# EasyEDA Pro project jtag_pin_convert.eprj

# Schematic Schematic1
Board Name: Board1; Create Date: 2024-12-11; Page Name: P1; Project Name: jtag_pin_convert; Schematic Name: Schematic1; Update Date: 2025-03-21; Company: 嘉立创EDA; Page Size: A4; Version: V1.0
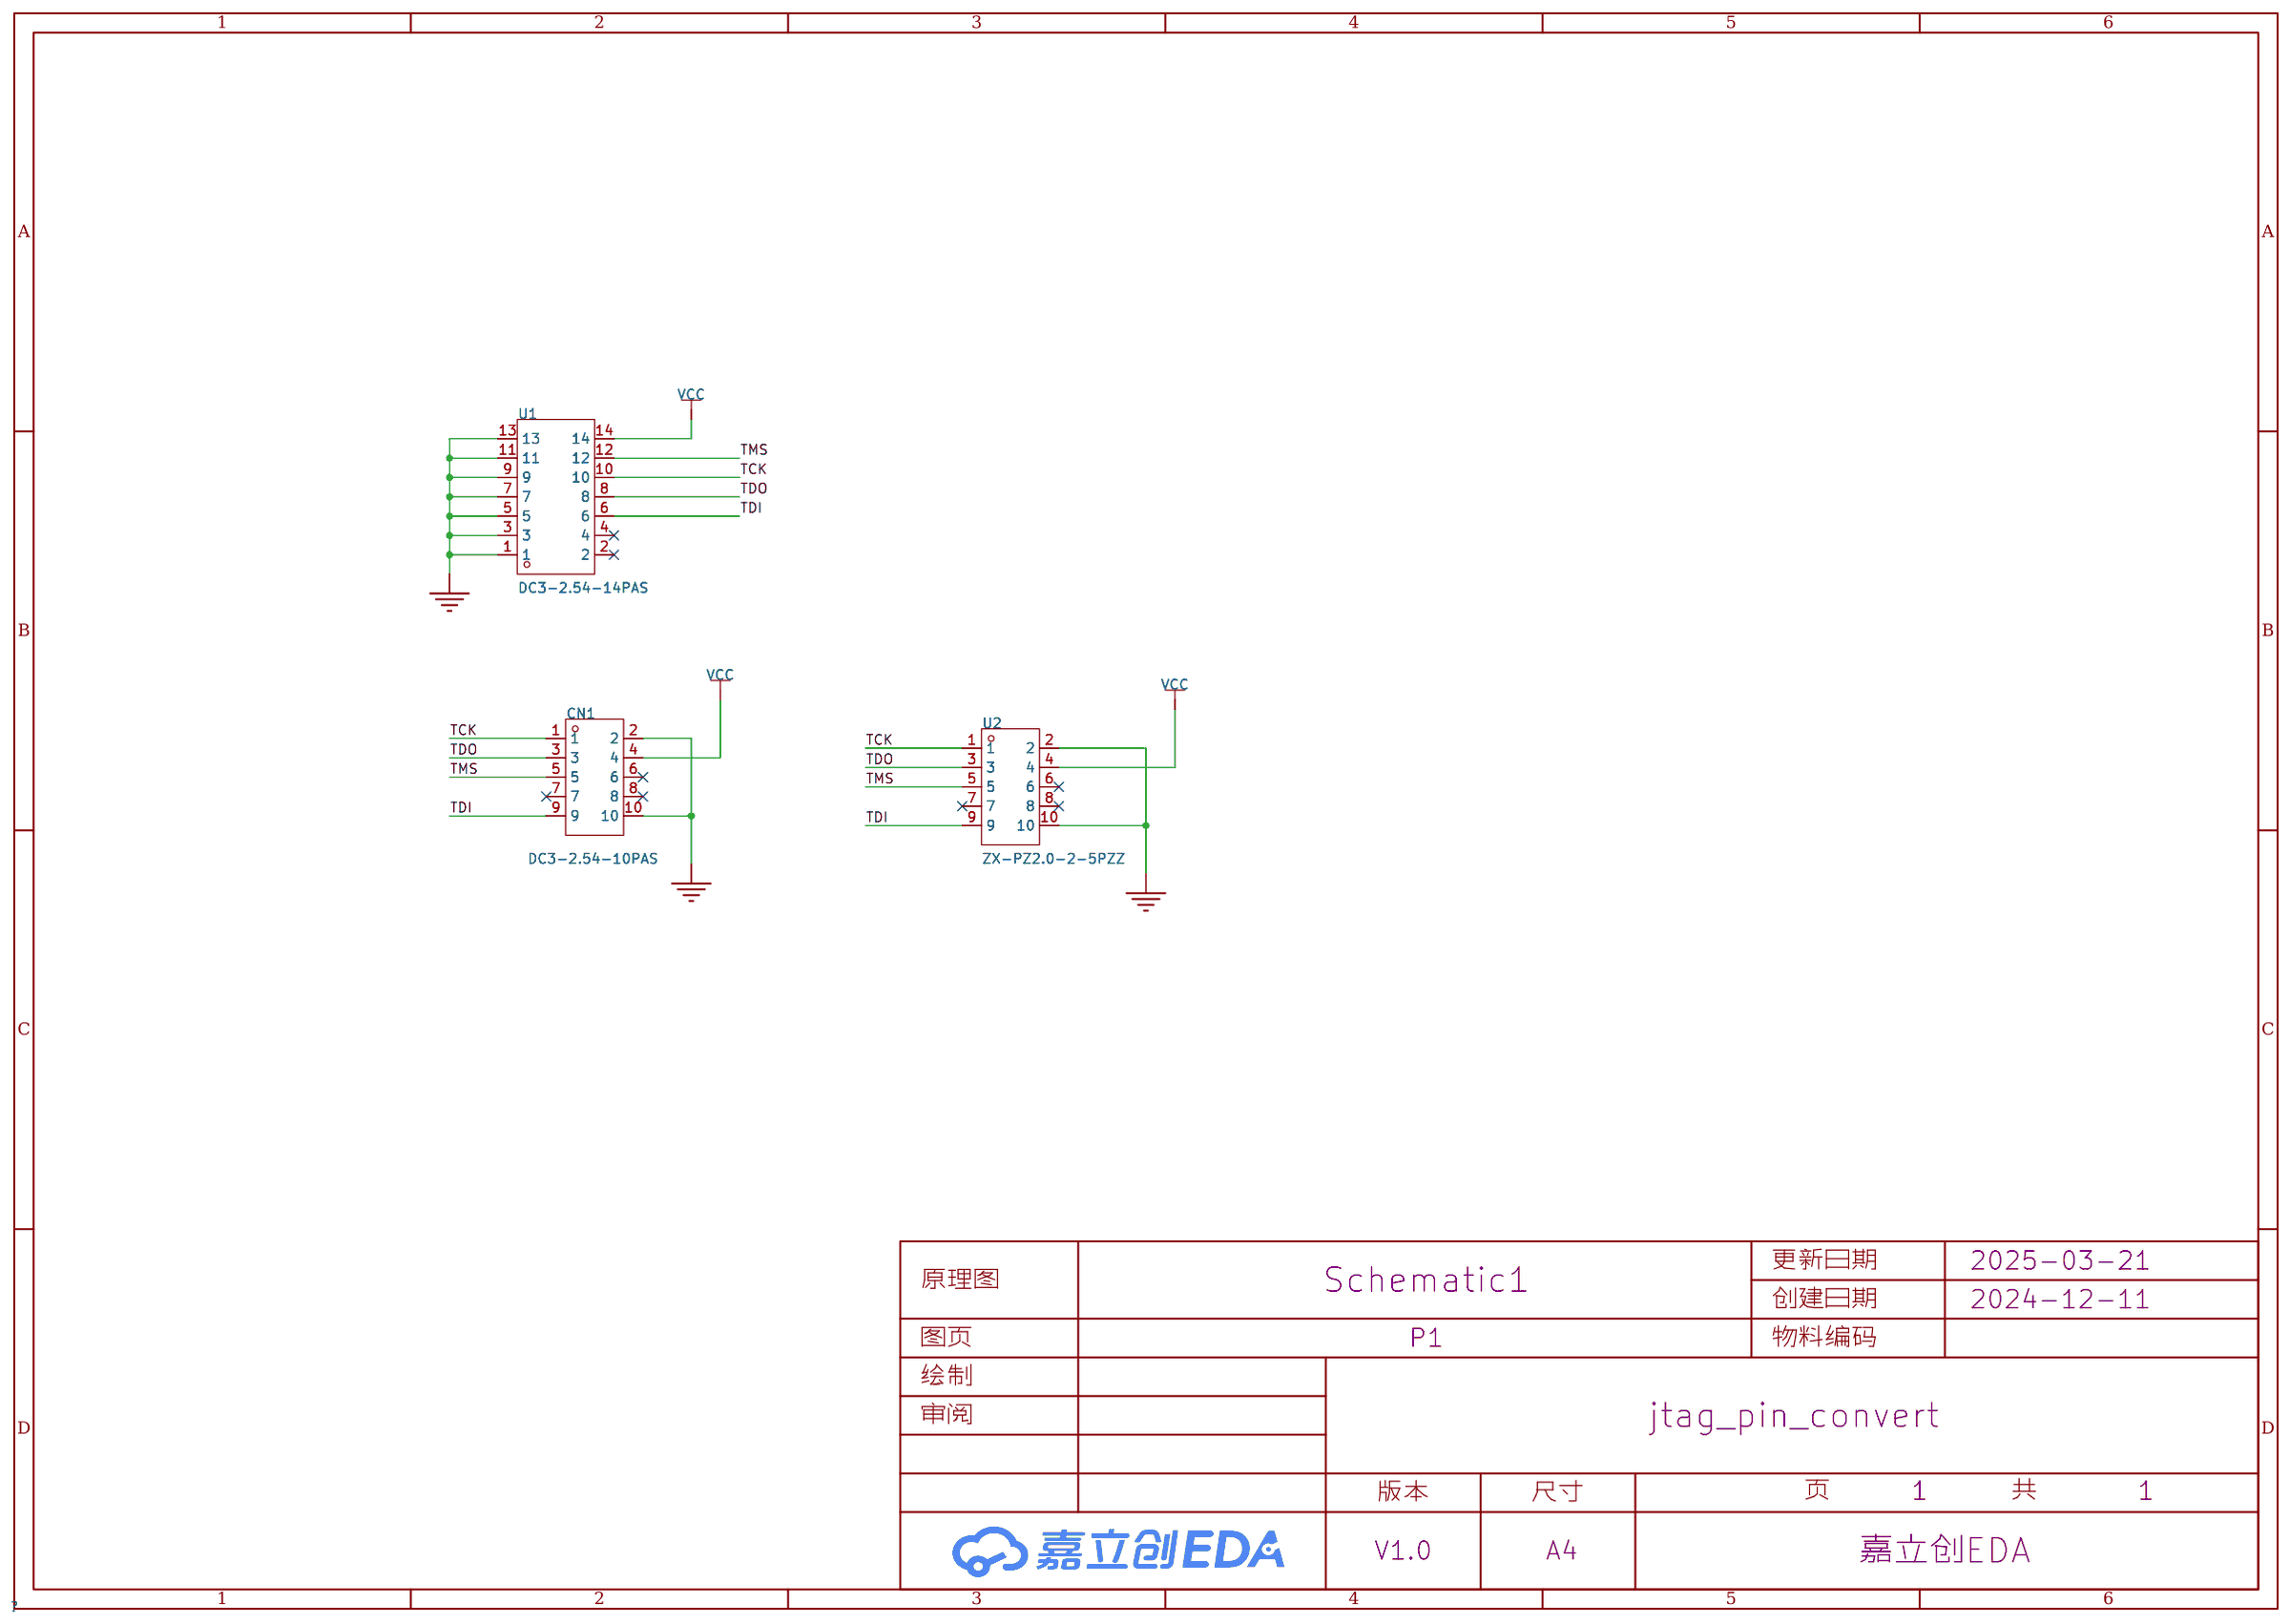
[diagram p0: schematic sheet]

## Parts
CN1  DC3-2.54-10PAS  [CONN-TH_10P-P2.54_DC3-2.54-10PAS]
U1  DC3-2.54-14PAS  [IDC-TH_14P-P2.54_DC3-2.54-14PAS]
U2  ZX-PZ2.0-2-5PZZ  [HDR-TH_10P-P2.00-V-M-R2-C5-S2.00]

## Library data of the parts
CN1 = DC3-2.54-10PAS: LCSC Part Name: 2.54mm 2x5P 排数:2 每排P数:5; Supplier Part: C2977596; Manufacturer: ZHOURI(洲日); Supplier Footprint: 插件,P=2.54mm; JLCPCB Part Class: 扩展库; Datasheet: https://atta.szlcsc.com/upload/public/pdf/source/20220328/11A926532DC2274A2EEDF295B10D1AB5.pdf; Supplier: LCSC; Connector Type: 简牛座; Pitch: 2.54mm; Structure: 2x5P; Current Rating (Max): 1.5A; Holder Type: 直插; Row Spacing: 2.54mm; Number of Rows: 2; Pin Number in each Row: 5; Operating Temperature Range: -40℃~+105℃
U1 = DC3-2.54-14PAS: LCSC Part Name: 2.54mm 2x7P 排数:2 每排P数:7; Supplier Part: C2977595; Manufacturer: ZHOURI(洲日); Supplier Footprint: 插件,P=2.54mm; JLCPCB Part Class: 扩展库; Datasheet: https://atta.szlcsc.com/upload/public/pdf/source/20220328/8C4F9C608F6421C8730FC92148E2CB6E.pdf; Supplier: LCSC; Connector Type: 简牛座; Pitch: 2.54mm; Structure: 2x7P; Current Rating (Max): 1.5A; Holder Type: 直插; Row Spacing: 2.54mm; Number of Rows: 2; Pin Number in each Row: 7; Operating Temperature Range: -40℃~+105℃
U2 = ZX-PZ2.0-2-5PZZ: LCSC Part Name: 2x5P 间距:2mm 方针 直插; Supplier Part: C7501288; Manufacturer: Megastar(兆星); Supplier Footprint: 插件,P=2mm; Datasheet: https://atta.szlcsc.com/upload/public/pdf/source/20231122/5A068C763F75A697CB422213713AF888.pdf; Supplier: LCSC; Pin Structure: 2x5P; Pitch: 2mm; Row Spacing: 2mm; Circluar Pins/Square Pins: 方针; Mounting Type: 直插; Number of Rows: 双排; Number of Pins: 10P; Current Rating (Max): 1.5A; Voltage Rating (Max): 500V; Length of Mating Pin: 3.9mm; Insulation Height: 2mm; Length of End Connection Pin: 2.8mm; Contact Material: 黄铜; Contact Plating: 金; Operating Temperature Range: -40℃~+105℃; Color: 黑色

## Nets
GND: CN1.2 CN1.10 U1.1 U1.3 U1.5 U1.7 U1.9 U1.11 U1.13 U2.2 U2.10
VCC: CN1.4 U1.14 U2.4
TCK: CN1.1 U1.10 U2.1
TDI: CN1.9 U1.6 U2.9
TDO: CN1.3 U1.8 U2.3
TMS: CN1.5 U1.12 U2.5

Not connected (* = marked no-connect by the designer): CN1 6* 7* 8*; U1 2* 4*; U2 6* 7* 8*

# Board PCB1
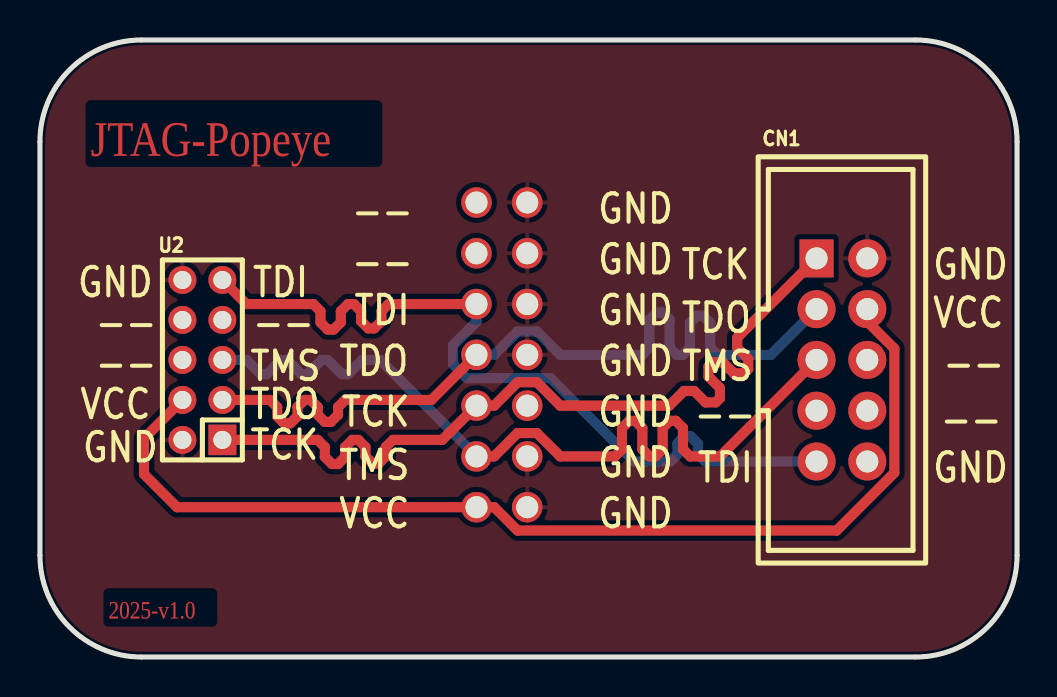
[diagram p1: board, top side]
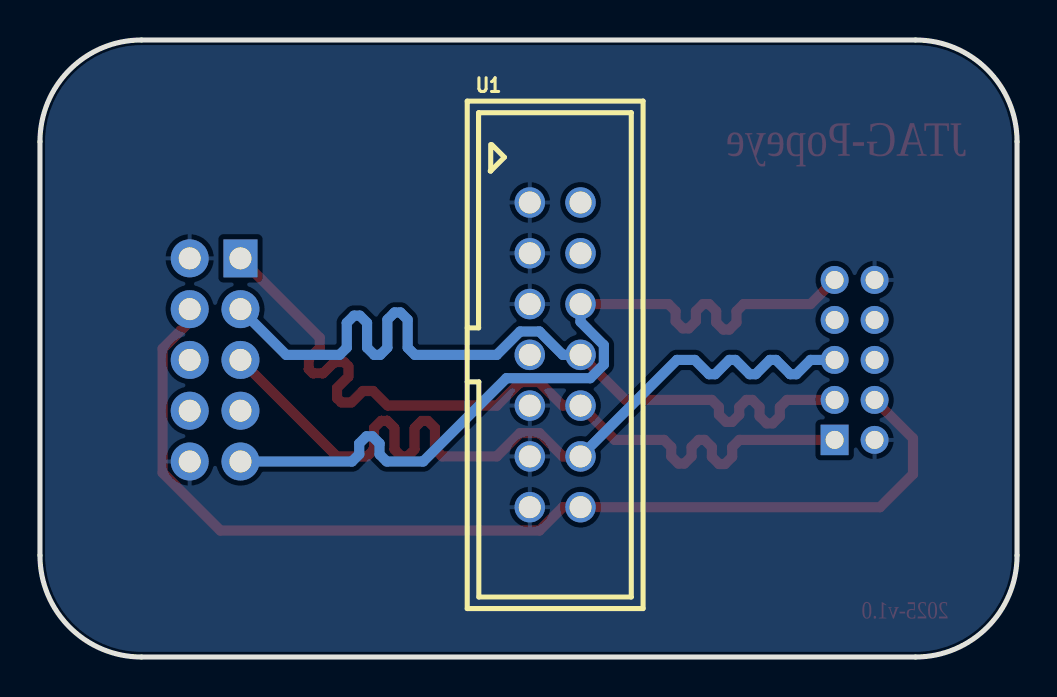
[diagram p2: board, bottom side, seen from below]

Outline 48.9 x 30.86 mm; copper layers: Top Layer, Bottom Layer. Coordinates in mm from the lower left corner of the outline.
Outline path: 0,25.78 0,5.08 arc(1.49,1.49) 5.08,0 43.81,0 arc(47.41,1.49) 48.9,5.08 48.9,25.78 arc(47.41,29.37) 43.81,30.86 5.08,30.86 arc(1.49,29.37) 0,25.78
Stack: Top Layer 0.035mm / Dielectric1 1.51mm FR4 er 4.5 / Bottom Layer 0.035mm

## Design rules (mm)
template: JLCPCB Capability(Two Layers Board)
spacing copperThickness1oz (default): track to track 0.102, other pairs 0.152 to 0.3
spacing copperThickness2oz: track to track 0.203, other pairs 0.152 to 0.3
track width copperThickness1oz (default): min 0.127, default 0.254, max 2.54
track width copperThickness2oz: min 0.203, default 0.254, max 2.54
differential pair differentialPair (default): width min 0.127, default 0.254, max 2.54; gap min 0.152, default 0.152
via viaSize (default): diameter min 0.5, default 0.61, max 10; hole min 0.3, default 0.305, max 6.3

## Placement (name value [footprint] x y rotation side)
CN1  DC3-2.54-10PAS  [CONN-TH_10P-P2.54_DC3-2.54-10PAS]  40.13 14.86 270 top
U1  DC3-2.54-14PAS  [IDC-TH_14P-P2.54_DC3-2.54-14PAS]  23.11 15.11 270 bottom
U2  ZX-PZ2.0-2-5PZZ  [HDR-TH_10P-P2.00-V-M-R2-C5-S2.00]  8.13 14.86 90 top

## Footprints (pads in the part's own frame, mm; a bottom-side part is the same pattern mirrored in y, then rotated)
CONN-TH_10P-P2.54_DC3-2.54-10PAS
  rect 1.9x1.7 hole 1.1: 1(-5.08,-1.27)
  round 1.9 hole 1.1: 2(-5.08,1.27) 3(-2.54,-1.27) 4(-2.54,1.27) 5(0,-1.27) 6(0,1.27) 7(2.54,-1.27) 8(2.54,1.27) 9(5.08,-1.27) 10(5.08,1.27)
HDR-TH_10P-P2.00-V-M-R2-C5-S2.00
  rect 1.524x1.4 hole 0.9: 1(-4,-1)
  round 1.4 hole 0.9: 2(-4,1) 3(-2,-1) 4(-2,1) 5(0,-1) 6(0,1) 7(2,-1) 8(2,1) 9(4,-1) 10(4,1)
IDC-TH_14P-P2.54_DC3-2.54-14PAS
  round 1.524 hole 1.1: 1(-7.62,-1.27) 2(-7.62,1.27) 3(-5.08,-1.27) 4(-5.08,1.27) 5(-2.54,-1.27) 6(-2.54,1.27) 7(0,-1.27) 8(0,1.27) 9(2.54,-1.27) 10(2.54,1.27) 11(5.08,-1.27) 12(5.08,1.27) 13(7.62,-1.27) 14(7.62,1.27)

## Nets
As in the schematic.

Pads without a net: CN1 6 7 8; U1 2 4; U2 6 7 8

## Routing (per net, layer and track width the routed paths; a pad name or vN(x,y) marks a point on that pad's centre or on a via; arc(x,y) is an arc through that point)
VCC: length 53.2
  Top Layer w0.508: U2.4 5.21,10.94 5.21,9.14 6.86,7.49 U1.14 22.73,7.49 23.9,6.33 39.87,6.33 42.76,9.22 42.76,15.42 41.4,16.78 CN1.4
TCK: length 41.9
  Top Layer w0.508: CN1.1 34.89,15.97 34.89,15.46 35.44,14.91 35.44,14.4 35.23,14.19 34.73,14.19 34.17,14.74 33.67,14.74 33.46,14.53 33.46,14.02 34.03,13.45 34.03,12.94 33.82,12.73 33.31,12.73 32.74,13.31 32.23,13.31 31.5,12.57 26.04,12.57 24.87,13.74 23.9,13.74 22.73,12.57 U1.10 20.13,10.86 17.66,10.86 17.3,10.5 17.3,10.03 16.94,9.67 16.65,9.67 16.29,10.03 16.29,10.5 15.93,10.86 15.63,10.86 15.27,10.5 15.27,10.01 14.91,9.65 14.62,9.65 14.26,10.01 14.26,10.5 13.9,10.86 U2.1
TDI: length 41.9
  Top Layer w0.508: U2.9 10.33,17.65 13.68,17.65 14.04,17.29 14.04,16.74 14.4,16.38 14.7,16.38 15.06,16.74 15.06,17.29 15.41,17.65 15.71,17.65 16.07,17.29 16.07,16.8 16.43,16.44 16.73,16.44 17.09,16.8 17.09,17.29 17.45,17.65 U1.6
  Bottom Layer w0.508: U1.6 21.84,16.77 20.68,15.6 20.68,14.63 21.36,13.94 25.55,13.94 29.72,9.78 31.54,9.78 31.9,10.14 31.9,10.68 32.26,11.04 32.56,11.04 32.92,10.68 32.92,10.14 33.28,9.78 CN1.9
TDO: length 41.9
  Top Layer w0.508: U2.3 11.51,12.86 11.87,12.5 11.87,12.04 12.23,11.68 12.53,11.68 12.89,12.04 12.89,12.5 13.24,12.86 13.54,12.86 13.9,12.5 13.9,12.12 14.26,11.76 14.56,11.76 14.92,12.12 14.92,12.5 15.28,12.86 19.59,12.86 U1.8
  Bottom Layer w0.508: CN1.3 36.58,15.11 33.9,15.11 33.54,15.47 33.54,16.71 33.18,17.07 32.89,17.07 32.53,16.71 32.53,15.47 32.17,15.11 31.87,15.11 31.51,15.47 31.51,16.87 31.15,17.23 30.85,17.23 30.49,16.87 30.49,15.47 30.13,15.11 26.04,15.11 24.87,16.28 23.9,16.28 22.73,15.11 U1.8
TMS: length 41.9
  Top Layer w0.508: CN1.5 34.04,10.03 32.54,10.03 32.18,10.39 32.18,11.45 31.82,11.81 31.52,11.81 31.16,11.45 31.16,10.39 30.8,10.03 30.5,10.03 30.14,10.39 30.14,11.45 29.78,11.81 29.49,11.81 29.13,11.45 29.13,10.39 28.77,10.03 26.04,10.03 24.87,11.2 23.9,11.2 22.73,10.03 U1.12
  Bottom Layer w0.508: U2.5 10.33,14.86 11.05,14.14 11.35,14.14 12.06,14.86 12.36,14.86 13.08,14.14 13.38,14.14 14.09,14.86 14.4,14.86 15.11,14.14 15.41,14.14 16.13,14.86 17.02,14.86 U1.12

## Copper pours and planes (outline as drawn; the poured copper is in the pictures)
GND on Top Layer: -1.02,32 50.16,32 50.16,-1.52 -1.02,-1.52
GND on Bottom Layer: -0.38,31.37 49.66,31.37 49.66,-1.14 -0.38,-1.14

## Text on the board
Top Layer: 2025-v1.0 | JTAG-Popeye
Top Silkscreen Layer: GND | VCC | -- | TMS | TDO | TCK | TDI
